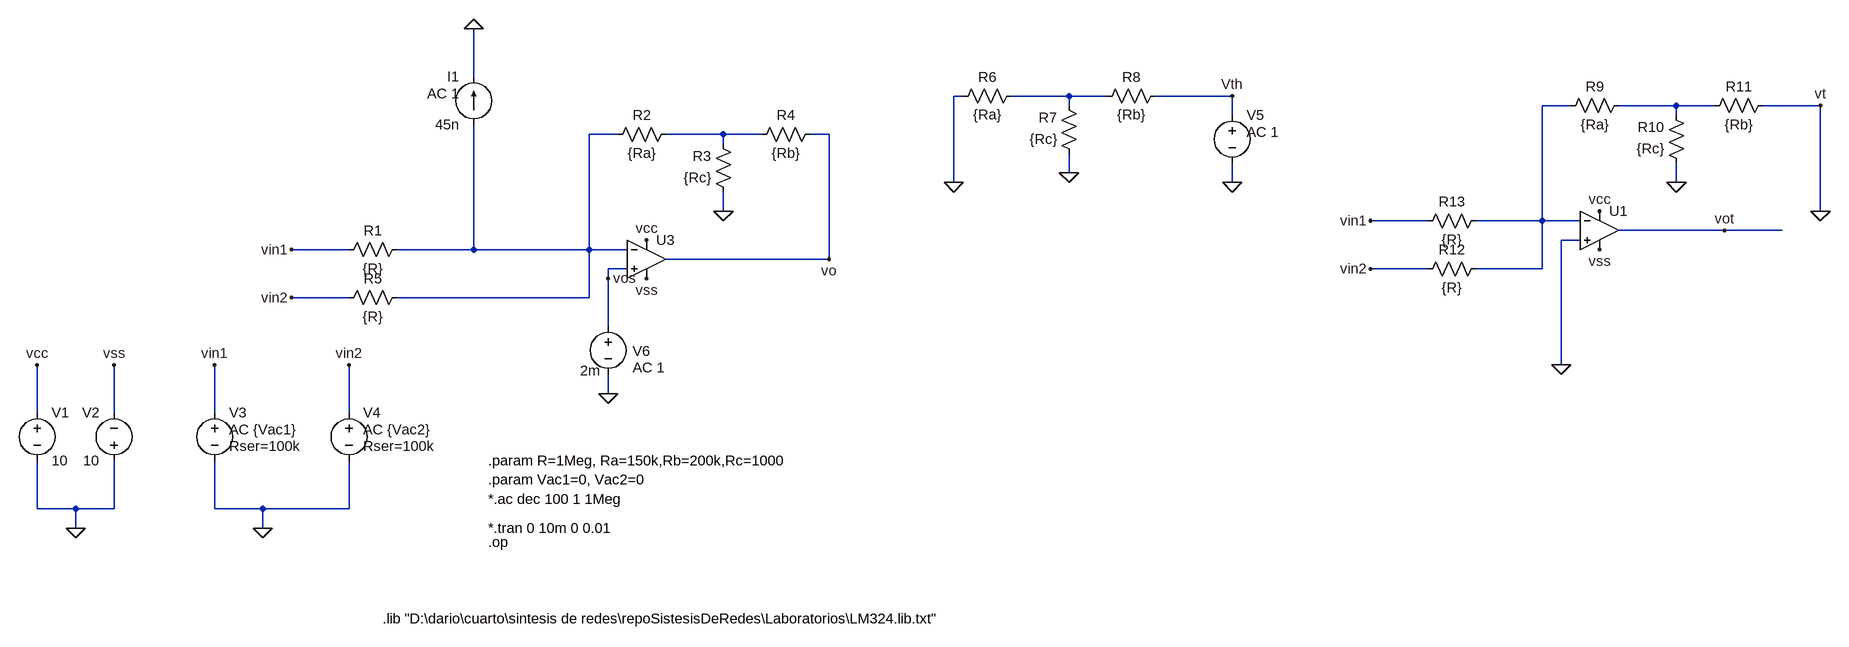
[diagram p0: schematic sumador.asc]
sumador.asc, the LTspice schematic file:
Version 4
SHEET 1 3460 680
WIRE 304 -752 304 -832
WIRE 1120 -720 1104 -720
WIRE 1296 -720 1200 -720
WIRE 1360 -720 1296 -720
WIRE 1568 -720 1440 -720
WIRE 1296 -704 1296 -720
WIRE 2464 -704 2416 -704
WIRE 2640 -704 2544 -704
WIRE 2704 -704 2640 -704
WIRE 2880 -704 2784 -704
WIRE 1568 -688 1568 -720
WIRE 2640 -688 2640 -704
WIRE 544 -656 496 -656
WIRE 720 -656 624 -656
WIRE 784 -656 720 -656
WIRE 896 -656 864 -656
WIRE 720 -640 720 -656
WIRE 1296 -592 1296 -624
WIRE 1104 -576 1104 -720
WIRE 1568 -576 1568 -608
WIRE 2640 -576 2640 -608
WIRE 720 -528 720 -560
WIRE 2880 -528 2880 -704
WIRE 2016 -512 1920 -512
WIRE 2416 -512 2416 -704
WIRE 2416 -512 2096 -512
WIRE 2480 -512 2416 -512
WIRE 2720 -496 2544 -496
WIRE 2816 -496 2720 -496
WIRE 2480 -480 2448 -480
WIRE 96 -464 0 -464
WIRE 304 -464 304 -672
WIRE 304 -464 176 -464
WIRE 496 -464 496 -656
WIRE 496 -464 304 -464
WIRE 560 -464 496 -464
WIRE 896 -448 896 -656
WIRE 896 -448 624 -448
WIRE 560 -432 528 -432
WIRE 2016 -432 1920 -432
WIRE 2416 -432 2416 -512
WIRE 2416 -432 2096 -432
WIRE 528 -416 528 -432
WIRE 96 -384 0 -384
WIRE 496 -384 496 -464
WIRE 496 -384 176 -384
WIRE 528 -336 528 -416
WIRE 2448 -272 2448 -480
WIRE 528 -224 528 -256
WIRE -432 -192 -432 -272
WIRE -304 -192 -304 -272
WIRE -128 -192 -128 -272
WIRE 96 -192 96 -272
WIRE -432 -32 -432 -112
WIRE -368 -32 -432 -32
WIRE -304 -32 -304 -112
WIRE -304 -32 -368 -32
WIRE -128 -32 -128 -112
WIRE -48 -32 -128 -32
WIRE 96 -32 96 -112
WIRE 96 -32 -48 -32
WIRE -368 0 -368 -32
WIRE -48 0 -48 -32
FLAG -368 0 0
FLAG -48 0 0
FLAG 720 -528 0
FLAG 528 -224 0
FLAG -128 -272 vin1
FLAG 96 -272 vin2
FLAG 0 -464 vin1
FLAG 0 -384 vin2
FLAG -432 -272 vcc
FLAG -304 -272 vss
FLAG 592 -416 vss
FLAG 592 -480 vcc
FLAG 896 -448 vo
FLAG 1296 -592 0
FLAG 1104 -576 0
FLAG 1568 -576 0
FLAG 1568 -720 Vth
FLAG 304 -832 0
FLAG 528 -416 vos
FLAG 2640 -576 0
FLAG 2448 -272 0
FLAG 1920 -512 vin1
FLAG 1920 -432 vin2
FLAG 2512 -464 vss
FLAG 2512 -528 vcc
FLAG 2880 -528 0
FLAG 2880 -704 vt
FLAG 2720 -496 vot
DATAFLAG 800 -448 ""
SYMBOL voltage -432 -208 R0
WINDOW 123 0 0 Left 0
WINDOW 39 0 0 Left 0
SYMATTR InstName V1
SYMATTR Value 10
SYMBOL voltage -304 -96 R180
WINDOW 0 24 96 Left 2
WINDOW 3 24 16 Left 2
WINDOW 123 0 0 Left 0
WINDOW 39 0 0 Left 0
SYMATTR InstName V2
SYMATTR Value 10
SYMBOL voltage -128 -208 R0
WINDOW 123 24 44 Left 2
WINDOW 39 24 72 Left 2
WINDOW 3 24 100 Left 2
SYMATTR Value2 AC {Vac1}
SYMATTR SpiceLine Rser=100k
SYMATTR Value ""
SYMATTR InstName V3
SYMBOL voltage 96 -208 R0
WINDOW 123 24 44 Left 2
WINDOW 39 24 72 Left 2
WINDOW 3 24 100 Left 2
SYMATTR Value2 AC {Vac2}
SYMATTR SpiceLine Rser=100k
SYMATTR Value ""
SYMATTR InstName V4
SYMBOL res 640 -672 R90
WINDOW 0 0 56 VBottom 2
WINDOW 3 32 56 VTop 2
SYMATTR InstName R2
SYMATTR Value {Ra}
SYMBOL res 736 -544 R180
WINDOW 0 36 76 Left 2
WINDOW 3 36 40 Left 2
SYMATTR InstName R3
SYMATTR Value {Rc}
SYMBOL res 768 -640 R270
WINDOW 0 32 56 VTop 2
WINDOW 3 0 56 VBottom 2
SYMATTR InstName R4
SYMATTR Value {Rb}
SYMBOL res 192 -400 R90
WINDOW 0 0 56 VBottom 2
WINDOW 3 32 56 VTop 2
SYMATTR InstName R5
SYMATTR Value {R}
SYMBOL res 192 -480 R90
WINDOW 0 0 56 VBottom 2
WINDOW 3 32 56 VTop 2
SYMATTR InstName R1
SYMATTR Value {R}
SYMBOL res 1216 -736 R90
WINDOW 0 0 56 VBottom 2
WINDOW 3 32 56 VTop 2
SYMATTR InstName R6
SYMATTR Value {Ra}
SYMBOL res 1312 -608 R180
WINDOW 0 36 76 Left 2
WINDOW 3 36 40 Left 2
SYMATTR InstName R7
SYMATTR Value {Rc}
SYMBOL res 1344 -704 R270
WINDOW 0 32 56 VTop 2
WINDOW 3 0 56 VBottom 2
SYMATTR InstName R8
SYMATTR Value {Rb}
SYMBOL voltage 1568 -704 R0
WINDOW 123 24 44 Left 2
WINDOW 39 0 0 Left 0
SYMATTR Value2 AC 1
SYMATTR InstName V5
SYMATTR Value ""
SYMBOL voltage 528 -352 R0
WINDOW 0 41 57 Left 2
WINDOW 123 41 85 Left 2
WINDOW 39 0 0 Left 0
WINDOW 3 -47 90 Left 2
SYMATTR InstName V6
SYMATTR Value2 AC 1
SYMATTR Value 2m
SYMBOL current 304 -672 R180
WINDOW 0 24 80 Left 2
WINDOW 3 24 0 Left 2
WINDOW 123 24 52 Left 2
WINDOW 39 0 0 Left 0
SYMATTR InstName I1
SYMATTR Value 45n
SYMATTR Value2 AC 1
SYMBOL Opamps\\UniversalOpamp2 592 -448 R0
SYMATTR InstName U3
SYMATTR Value2 Avol=100K GBW=1Meg Slew=.5Meg
SYMATTR SpiceLine2 en=0 enk=0 in=0 ink=0 Rin=1Meg
SYMBOL res 2560 -720 R90
WINDOW 0 0 56 VBottom 2
WINDOW 3 32 56 VTop 2
SYMATTR InstName R9
SYMATTR Value {Ra}
SYMBOL res 2656 -592 R180
WINDOW 0 36 76 Left 2
WINDOW 3 36 40 Left 2
SYMATTR InstName R10
SYMATTR Value {Rc}
SYMBOL res 2688 -688 R270
WINDOW 0 32 56 VTop 2
WINDOW 3 0 56 VBottom 2
SYMATTR InstName R11
SYMATTR Value {Rb}
SYMBOL res 2112 -448 R90
WINDOW 0 0 56 VBottom 2
WINDOW 3 32 56 VTop 2
SYMATTR InstName R12
SYMATTR Value {R}
SYMBOL res 2112 -528 R90
WINDOW 0 0 56 VBottom 2
WINDOW 3 32 56 VTop 2
SYMATTR InstName R13
SYMATTR Value {R}
SYMBOL Opamps\\UniversalOpamp2 2512 -496 R0
SYMATTR InstName U1
SYMATTR Value2 Avol=100K GBW=10Meg Slew=.5Meg
TEXT 152 168 Left 2 !.lib "D:\\dario\\cuarto\\sintesis de redes\\repoSistesisDeRedes\\Laboratorios\\LM324.lib.txt"
TEXT 328 -112 Left 2 !.param R=1Meg, Ra=150k,Rb=200k,Rc=1000\n.param Vac1=0, Vac2=0
TEXT 328 -48 Left 2 !*.ac dec 100 1 1Meg
TEXT 328 0 Left 2 !*.tran 0 10m 0 0.01
TEXT 328 24 Left 2 !.op

The netlist it stands for:
* sumador.asc
V1 vcc 0 10
V2 0 vss 10
V3 vin1 0 AC {Vac1} Rser=100k
V4 vin2 0 AC {Vac2} Rser=100k
R2 N005 N004 {Ra}
R3 0 N005 {Rc}
R4 N005 vo {Rb}
R5 N004 vin2 {R}
R1 N004 vin1 {R}
R6 N001 0 {Ra}
R7 0 N001 {Rc}
R8 N001 Vth {Rb}
V5 Vth 0 AC 1
V6 vos 0 2m AC 1
I1 N004 0 45n AC 1
XU3 vos N004 vcc vss vo level.2 Avol=100K GBW=1Meg Slew=.5Meg ilimit=25m rail=0 Vos=0 phimargin=45 en=0 enk=0 in=0 ink=0 Rin=1Meg  ; pins IN+ IN- V+ V- OUT
R9 N003 N002 {Ra}
R10 0 N003 {Rc}
R11 N003 0 {Rb}
R12 N002 vin2 {R}
R13 N002 vin1 {R}
XU1 0 N002 vcc vss vot level.2 Avol=100K GBW=10Meg Slew=.5Meg ilimit=25m rail=0 Vos=0 phimargin=45 en=0 enk=0 in=0 ink=0 Rin=500Meg  ; pins IN+ IN- V+ V- OUT
.lib "D:\dario\cuarto\sintesis de redes\repoSistesisDeRedes\Laboratorios\LM324.lib.txt"
.param R=1Meg, Ra=150k,Rb=200k,Rc=1000
.param Vac1=0, Vac2=0
*.ac dec 100 1 1Meg
*.tran 0 10m 0 0.01
.op
.lib UniversalOpamps2.sub
.backanno
.end